# Altium schematic sheet HDMI.SchDoc
size A4; SheetNumber: 5; SheetTotal: 6
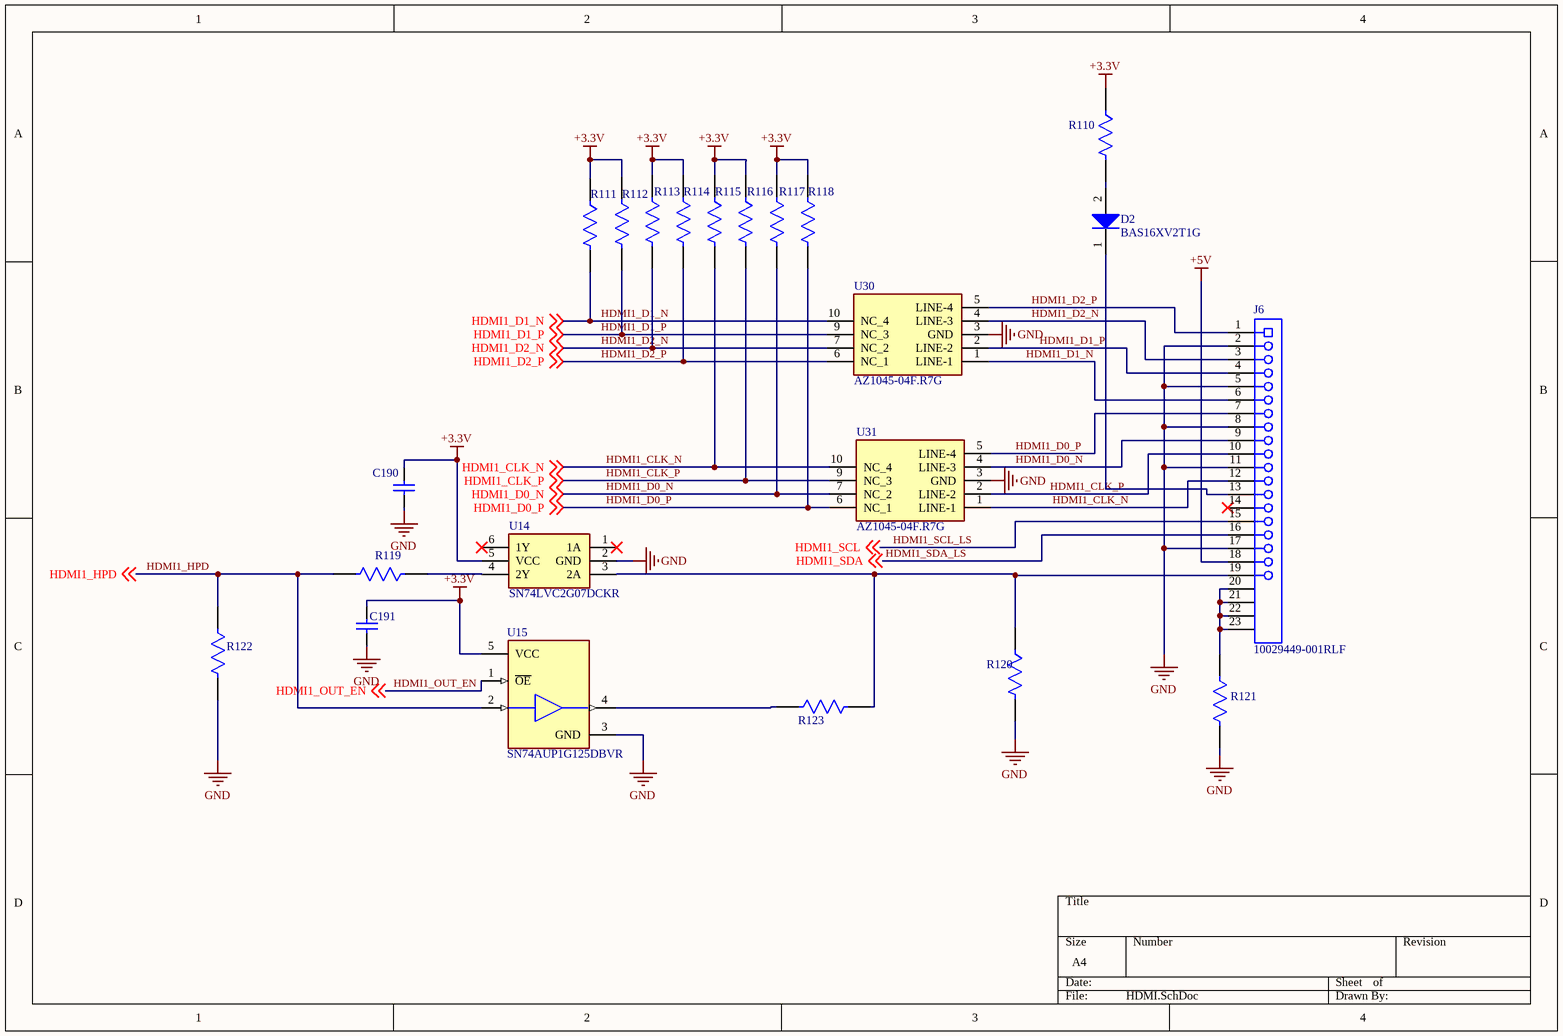
[diagram p0: HDMI.SchDoc]

## Parts
C190  VJ0805Y152KXAAC  [CAPC2013X145X48NL20T23]  (value not drawn)
C191  VJ0805Y152KXAAC  [CAPC2013X145X48NL20T23]  (value not drawn)
D2  BAS16XV2T1G  [ONSC-SOD-523-2-502-01_V]
J6  10029449-001RLF  [FCI-10029449-001RLF_V]
R110  MCU0805MD4991BP100  [FP-MCU0805-MFG]  (value not drawn)
R111  MCU0805MD4991BP100  [FP-MCU0805-MFG]  (value not drawn)
R112  MCU0805MD4991BP100  [FP-MCU0805-MFG]  (value not drawn)
R113  MCU0805MD4991BP100  [FP-MCU0805-MFG]  (value not drawn)
R114  MCU0805MD4991BP100  [FP-MCU0805-MFG]  (value not drawn)
R115  MCU0805MD4991BP100  [FP-MCU0805-MFG]  (value not drawn)
R116  MCU0805MD4991BP100  [FP-MCU0805-MFG]  (value not drawn)
R117  MCU0805MD4991BP100  [FP-MCU0805-MFG]  (value not drawn)
R118  MCU0805MD4991BP100  [FP-MCU0805-MFG]  (value not drawn)
R119  MCU0805MD4991BP100  [FP-MCU0805-MFG]  (value not drawn)
R120  MCU0805MD4991BP100  [FP-MCU0805-MFG]  (value not drawn)
R121  MCU0805MD4991BP100  [FP-MCU0805-MFG]  (value not drawn)
R122  MCU0805MD4991BP100  [FP-MCU0805-MFG]  (value not drawn)
R123  MCU0805MD4991BP100  [FP-MCU0805-MFG]  (value not drawn)
U14  SN74LVC2G07DCKR  [SOT65P210X110-6N]
U15  SN74AUP1G125DBVR  [FP-DBV0005A-IPC_C]
U30  AZ1045-04F.R7G  [AZ104504FR7G]
U31  AZ1045-04F.R7G  [AZ104504FR7G]

## Nets
+3.3V: C190.2 C191.2 R110.1 R111.1 R112.1 R113.1 R114.1 R115.1 R116.1 R117.1 R118.1 U14.5(VCC) U15.5(VCC)
+5V: J6.18
GND: C190.1 C191.1 J6.2 J6.5 J6.8 J6.11 J6.17 R120.2 R121.2 R122.2 U14.2(GND) U15.3(GND) U30.3(GND) U31.3(GND)
HDMI1_CLK_N: J6.12 R115.2 U31.1(LINE-1) U31.10(NC_4) ; off-sheet HDMI1_CLK_N
HDMI1_CLK_P: J6.10 R116.2 U31.2(LINE-2) U31.9(NC_3) ; off-sheet HDMI1_CLK_P
HDMI1_D0_N: J6.9 R117.2 U31.4(LINE-3) U31.7(NC_2) ; off-sheet HDMI1_D0_N
HDMI1_D0_P: J6.7 R118.2 U31.5(LINE-4) U31.6(NC_1) ; off-sheet HDMI1_D0_P
HDMI1_D1_N: J6.6 R111.2 U30.1(LINE-1) U30.10(NC_4) ; off-sheet HDMI1_D1_N
HDMI1_D1_P: J6.4 R112.2 U30.2(LINE-2) U30.9(NC_3) ; off-sheet HDMI1_D1_P
HDMI1_D2_N: J6.3 R113.2 U30.4(LINE-3) U30.7(NC_2) ; off-sheet HDMI1_D2_N
HDMI1_D2_P: J6.1 R114.2 U30.5(LINE-4) U30.6(NC_1) ; off-sheet HDMI1_D2_P
HDMI1_HPD: R119.2 R122.1 U15.2(A) ; off-sheet HDMI1_HPD
HDMI1_OUT_EN: U15.1(~{OE}) ; off-sheet HDMI1_OUT_EN
HDMI1_SCL_LS: J6.15 ; off-sheet HDMI1_SCL  [also labelled HDMI1_SCL]
HDMI1_SDA_LS: J6.16 ; off-sheet HDMI1_SDA  [also labelled HDMI1_SDA]
NetD2_1: D2.1(K) J6.13
NetD2_2: D2.2(A) R110.2
NetJ6_19: J6.19 R120.1 R123.2 U14.3(2A)
NetJ6_20: J6.20(SHLD1) J6.21(SHLD2) J6.22(SHLD3) J6.23(SHLD4) R121.1
NetR119_1: R119.1 U14.4(2Y)
NetR123_1: R123.1 U15.4(Y)

Not connected (* = marked no-connect by the designer): J6 14*; U14 1(1A)* 6(1Y)*

## Library data of the parts
C190 C191 = CMP-2007-01729-1: Manufacturer: Vitramon; Part Number: VJ0805Y152KXAAC
D2 = CMP-1054-00076-1: Switching Diode, 2-Pin SOD-523, Pb-Free, Tape and Reel; Manufacturer: On Semiconductor; trr Max (ns): 6; Configuration: Single; IF Max (A): 0.2; ComponentLink1URL: http://www.onsemi.com/; DatasheetVersion: Rev. 7; RoHS: TRUE; PackageVersion: Rev. E, 09/2010; Packing: Tape and Reel; ComponentLink2Description: Datasheet; ComponentLink2URL: http://www.onsemi.com/pub_link/Collateral/BAS16XV2T1-D.PDF; ComponentLink3Description: Package Specification; PackageReference: SOD-523-2-502-01; ComponentLink1Description: Manufacturer URL; PartNumber: BAS16XV2T1G; Mounting Technology: Surface Mount; PackageDescription: 2-Pin SOD, Body 1.2 x 0.8 mm; ComponentLink3URL: http://www.onsemi.com/pub_link/Collateral/502-01.PDF
J6 = CMP-1698-00003-1: Surface Mount Type A HDMI Receptacle without Flange, 19 Positions, 0.5 mm Pitch, -55 to 85 degC, RoHS, Tape and Reel; RoHSCompliant: false; PackageDescription: 19-Pin Surface Mount Device, Body 15 x 9 mm, Pitch 0.5 mm; ComponentLink1Description: Manufacturer URL; PackageReference: 10029449-001RLF; DatasheetVersion: Rev. S, 06/2012; ComponentLink1URL: http://portal.fciconnect.com/; ComponentLink2Description: Datasheet; ComponentLink2URL: https://datasheet.ciiva.com/851/10029449-851120.pdf
R110-R123 = CMP-02407-000217-1: RES 1.05K OHM 0.5% 1/5W 0805; Resistance: 4.99kR; Power Rating: 200mW; Tolerance: 0.1%; Voltage Rating: 150V; Weight: 0.000194oz; Package Quantity: 1000; Height: 0.52mm; Case Code (Imperial): 0805; Width: 1.25mm; Packaging: Tape and Reel; Case/Package: 0805; Length: 2mm; Composition: Thin Film; Termination: SMD/SMT; Min Operating Temperature: -55°C; Case Code (Metric): 2012; Max Operating Temperature: 155°C
U14 = SN74LVC2G07DCKR: Integrated Circuit; Manufacturer_Name: Texas Instruments; Datasheet Link: https://datasheet.lcsc.com/szlcsc/Texas-Instruments-TI-SN74LVC2G07DCKR_C7849.pdf; Height: 1.1mm; Manufacturer_Part_Number: SN74LVC2G07DCKR; Mouser Part Number: 595-SN74LVC2G07DCKR; Mouser Price/Stock: https://www.mouser.co.uk/ProductDetail/Texas-Instruments/SN74LVC2G07DCKR?qs=EIjG%252BN7kn%252Bn6uhrXwDLE9Q%3D%3D; Arrow Part Number: SN74LVC2G07DCKR; Arrow Price/Stock: https://www.arrow.com/en/products/sn74lvc2g07dckr/texas-instruments?region=nac
U15 = CMP-0859-00054-4: IC BUF NON-INVERT 3.6V SOT23-5; Propagation Delay: 18.7ns; Number of Elements: 1; High Level Output Current: -4mA; Quiescent Current: 500nA; Min Supply Voltage: 800mV; Output Type: 3-STATE; Logic Function: Buffer; Polarity: Non-Inverting; Turn-On Delay Time: 25.5ns; Low Level Output Current: 4mA; Lead Free: Lead Free; Number of Pins: 5; REACH SVHC: No SVHC; Radiation Hardening: No; Series: 74AUP; Packaging: Tape and Reel; Number of Channels: 1; Number of Outputs: 1; Number of Output Lines: 1; Max Operating Temperature: 85°C; Max Supply Voltage: 3.6V; Min Operating Temperature: -40°C; Number of Bits per Element: 1; Technology: CMOS; Number of Input Lines: 1; Case/Package: SOT-23; Number of Inputs: 1; Mount: Surface Mount; Number of Gates: 1; Number of Bits: 1; Package Quantity: 3000; RoHS Compliant: Yes
U30 U31 = AZ1045-04F.R7G: Diode ESD (Uni-directional); Manufacturer_Name: Amazing Microelectronic Corp.; Datasheet Link: https://download.datasheets.com/pdfs/2013/10/3/2/31/47/175/amzng_/manual/az1045-04f_datasheet.pdf?_ga=2.166408059.458781722.1648096097-1927931834.1642822301; Height: 0.55mm; Manufacturer_Part_Number: AZ1045-04F.R7G